# EAGLE design projekt (EAGLE 9.6.2)
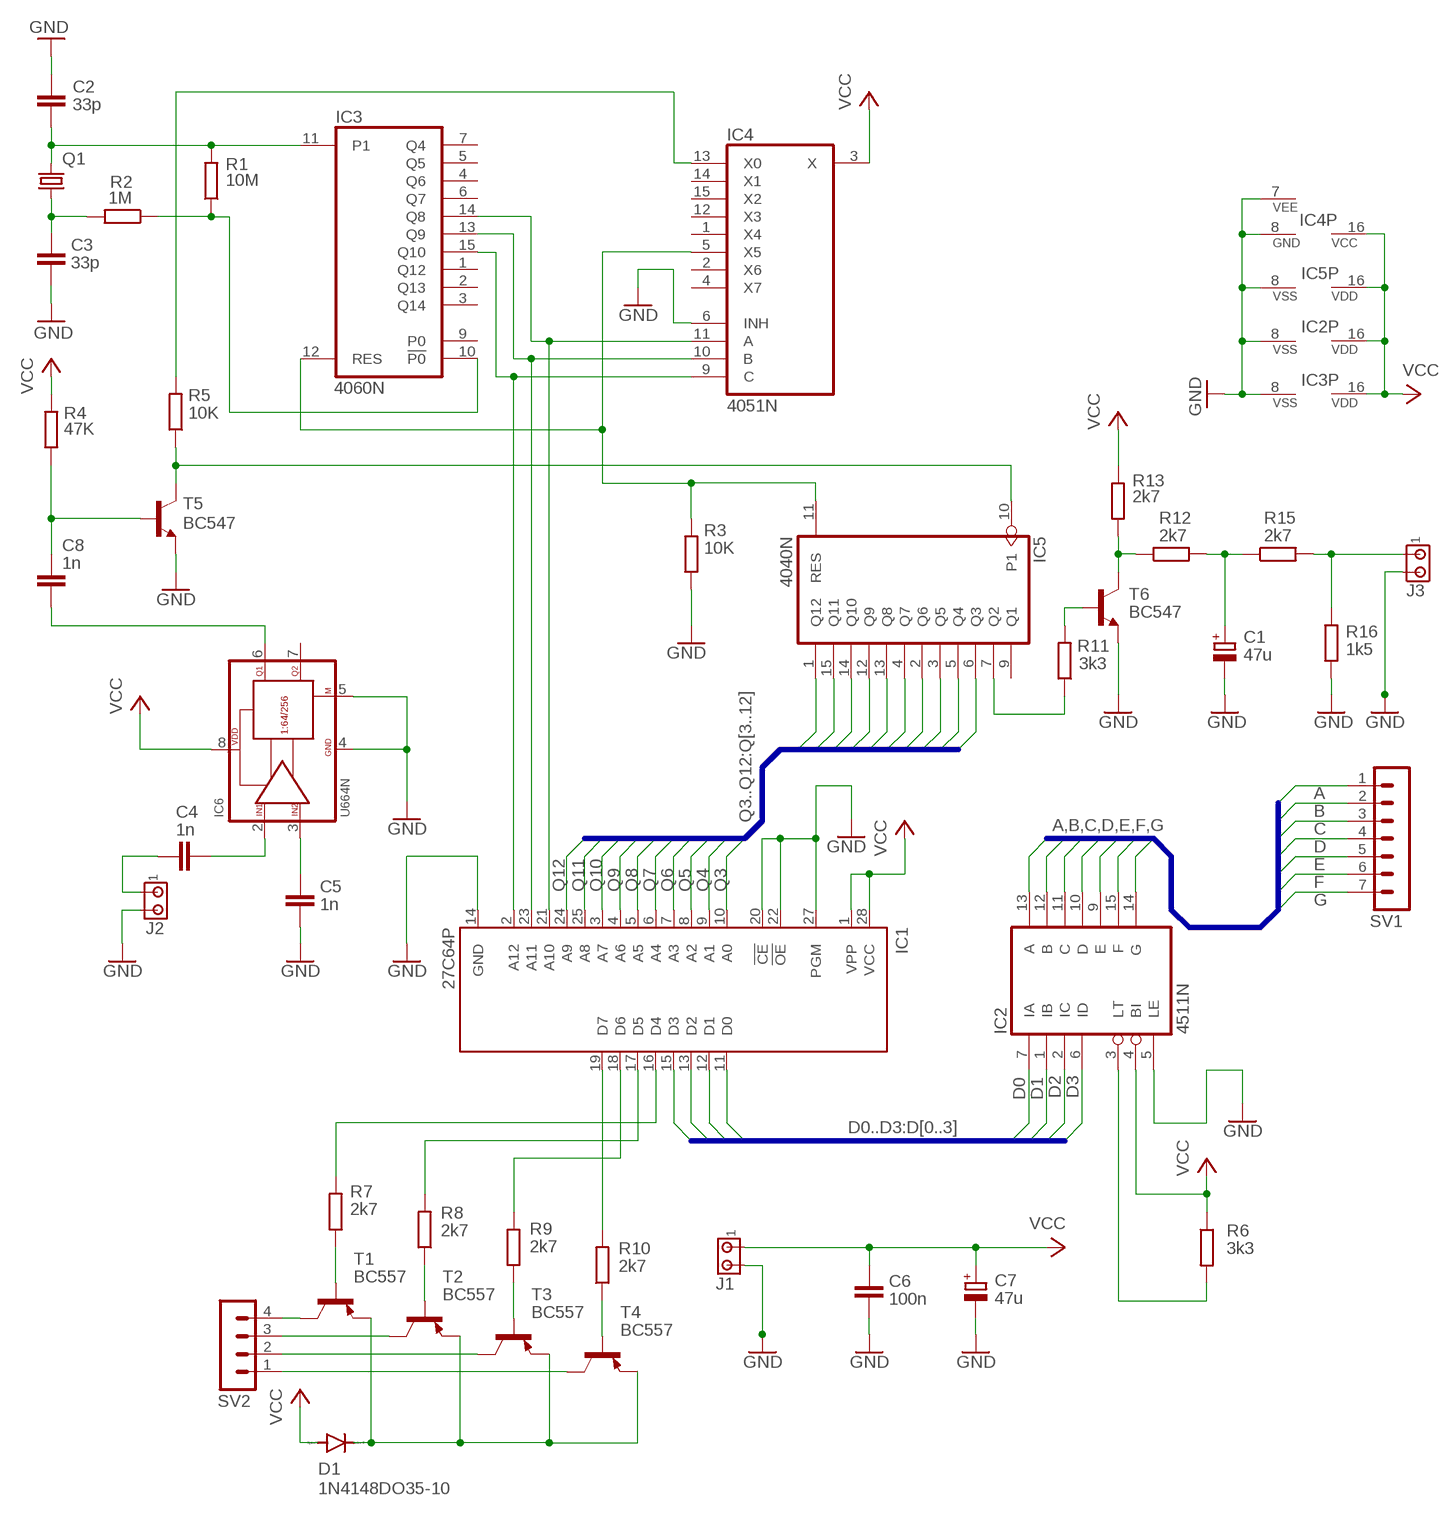
[diagram p0: schematic, sheet 1]

## Parts
C1  47u  CPOL-EUE2.5-6  [E2,5-6]
C2  33p  C-EU025-025X050  [C025-025X050]
C3  33p  C-EU025-025X050  [C025-025X050]
C4  1n  C-EU025-025X050  [C025-025X050]
C5  1n  C-EU025-025X050  [C025-025X050]
C6  100n  C-EU025-025X050  [C025-025X050]
C7  47u  CPOL-EUE2.5-6  [E2,5-6]
C8  1n  C-EU025-025X050  [C025-025X050]
D1  1N4148DO35-10  [DO35-10]
IC1  27C64P  [DIL28-6]
IC2  4511N  [DIL16]
IC3  4060N  [DIL16]
IC4  4051N  [DIL16]
IC5  4040N  [DIL16]
IC6  U664N  [DIL08]
J1  MTA02-100  [10X02MTA]
J2  MTA02-100  [10X02MTA]
J3  MTA02-100  [10X02MTA]
Q1  CRYSTALHC49S  [HC49/S]
R1  10M  R-EU_0207/10  [0207/10]
R2  1M  R-EU_0207/10  [0207/10]
R3  10K  R-EU_0207/10  [0207/10]
R4  47K  R-EU_0207/10  [0207/10]
R5  10K  R-EU_0207/10  [0207/10]
R6  3k3  R-EU_0207/10  [0207/10]
R7  2k7  R-EU_0207/10  [0207/10]
R8  2k7  R-EU_0207/10  [0207/10]
R9  2k7  R-EU_0207/10  [0207/10]
R10  2k7  R-EU_0207/10  [0207/10]
R11  3k3  R-EU_0207/10  [0207/10]
R12  2k7  R-EU_0207/10  [0207/10]
R13  2k7  R-EU_0207/10  [0207/10]
R15  2k7  R-EU_0207/10  [0207/10]
R16  1k5  R-EU_0207/10  [0207/10]
SV1  MA07-1  [MA07-1]
SV2  MA04-1  [MA04-1]
T1  BC557  [TO92]
T2  BC557  [TO92]
T3  BC557  [TO92]
T4  BC557  [TO92]
T5  BC547  [TO92]
T6  BC547  [TO92]

## Nets
A: IC2.13(A) SV1.1
B: IC2.12(B) SV1.2
C: IC2.11(C) SV1.3
D: IC2.10(D) SV1.4
D0: IC1.11(D0) IC2.7(IA)
D1: IC1.12(D1) IC2.1(IB)
D2: IC1.13(D2) IC2.2(IC)
D3: IC1.15(D3) IC2.6(ID)
E: IC2.9(E) SV1.5
F: IC2.15(F) SV1.6
G: IC2.14(G) SV1.7
GND: C1.- C2.1 C3.2 C5.2 C6.2 C7.- IC1.14(GND) IC1.20(!CE) IC1.22(!OE) IC1.27(PGM) IC2.5(LE) IC2.8(VSS) IC3.8(VSS) IC4.6(INH) IC4.7(VEE) IC4.8(GND) IC5.8(VSS) IC6.4(GND) IC6.5(FAKT) J1.2 J2.2 J3.2 R3.1 R16.1 T5.1(E) T6.1(E)
N$1: C2.2 IC3.11(P1) Q1.2 R1.2
N$2: C3.1 Q1.1 R2.2
N$3: IC3.10(!P0) R1.1 R2.1
N$4: IC1.21(A10) IC3.14(Q8) IC4.11(A)
N$5: IC1.23(A11) IC3.13(Q9) IC4.10(B)
N$6: IC1.2(A12) IC3.15(Q10) IC4.9(C)
N$7: IC3.12(RES) IC4.5(X5) IC5.11(RES) R3.2
N$8: C8.1 R4.1 T5.2(B)
N$9: C8.2 IC6.6(O1)
N$10: C5.1 IC6.3(I2)
N$11: C4.2 IC6.2(I1)
N$12: IC5.10(P1) R5.1 T5.3(C)
N$13: C4.1 J2.1
N$14: R12.1 R13.2 T6.3(C)
N$30: IC2.3(LT) R6.2
N$37: IC1.17(D5) R8.2
N$38: IC1.16(D4) R7.2
N$39: IC1.18(D6) R9.2
N$40: IC1.19(D7) R10.2
N$41: D1.C T1.1(E) T2.1(E) T3.1(E) T4.1(E)
N$42: R9.1 T3.2(B)
N$43: R8.1 T2.2(B)
N$44: R7.1 T1.2(B)
N$45: SV2.4 T1.3(C)
N$46: SV2.3 T2.3(C)
N$47: SV2.2 T3.3(C)
N$48: SV2.1 T4.3(C)
N$49: R10.1 T4.2(B)
N$50: IC5.7(Q2) R11.1
N$51: R11.2 T6.2(B)
N$52: C1.+ R12.2 R15.1
N$53: J3.1 R15.2 R16.2
N$62: IC4.13(X0) R5.2
Q3: IC1.10(A0) IC5.6(Q3)
Q4: IC1.9(A1) IC5.5(Q4)
Q5: IC1.8(A2) IC5.3(Q5)
Q6: IC1.7(A3) IC5.2(Q6)
Q7: IC1.6(A4) IC5.4(Q7)
Q8: IC1.5(A5) IC5.13(Q8)
Q9: IC1.4(A6) IC5.12(Q9)
Q10: IC1.3(A7) IC5.14(Q10)
Q11: IC1.25(A8) IC5.15(Q11)
Q12: IC1.24(A9) IC5.1(Q12)
VCC: C6.1 C7.+ D1.A IC1.1(VPP) IC1.28(VCC) IC2.4(BI) IC2.16(VDD) IC3.16(VDD) IC4.3(X) IC4.16(VCC) IC5.16(VDD) IC6.8(VPP) J1.1 R4.2 R6.1 R13.1
Unconnected: IC1.26(NC) IC3.1(Q12) IC3.2(Q13) IC3.3(Q14) IC3.4(Q6) IC3.5(Q5) IC3.6(Q7) IC3.7(Q4) IC3.9(P0) IC4.1(X4) IC4.2(X6) IC4.4(X7) IC4.12(X3) IC4.14(X1) IC4.15(X2) IC5.9(Q1) IC6.7(O2)

## Buses
Q3..Q12:Q[3..12]
D0..D3:D[0..3]
A,B,C,D,E,F,G

## Library data of the parts
C1 C7 = rcl:CPOL-EU: POLARIZED CAPACITOR, European symbol; SPICEPREFIX: C
C2-C6 C8 = rcl:C-EU: CAPACITOR, European symbol; SPICEPREFIX: C
D1 = diode:1N4148: DIODE high speed (Philips)
IC1 = microchip:27*64: CMOS EPROM 64 K (8 K x 8), low voltage; MF: Arrow Electronics; MPN: M27C64A-10F1; OC_FARNELL: 1094265; OC_NEWARK: 93K7339
IC2 = 45xx:4511: BCD to 7-segment LATCH/DECODER/DRIVER
IC3 = 40xx:4060: 14-stage binary/ripple COUNTER
IC4 = 40xx:4051: 8-channel ANALOG MULTIPLEXER
IC5 = 40xx:4040: 12-stage binary/ripple COUNTER
IC6 = U664:U664: High-Frequency prescaler for TV and VTR purposes U664/U981/SDA4212
J1-J3 = con-amp:MTA02-100: AMP connector
Q1 = crystal:CRYSTAL: CRYSTAL; OC_FARNELL: 1667008; OC_NEWARK: unknown
R1-R13 R15 R16 = rcl:R-EU_: RESISTOR, European symbol; SPICEPREFIX: R
SV1 = con-lstb:MA07-1: PIN HEADER; OC_FARNELL: unknown; OC_NEWARK: unknown
SV2 = con-lstb:MA04-1: PIN HEADER; OC_FARNELL: unknown; OC_NEWARK: unknown
T1-T4 = transistor-pnp:BC557: PNP Transistor
T5 T6 = transistor:BC547: NPN TRANSISTOR

## Board
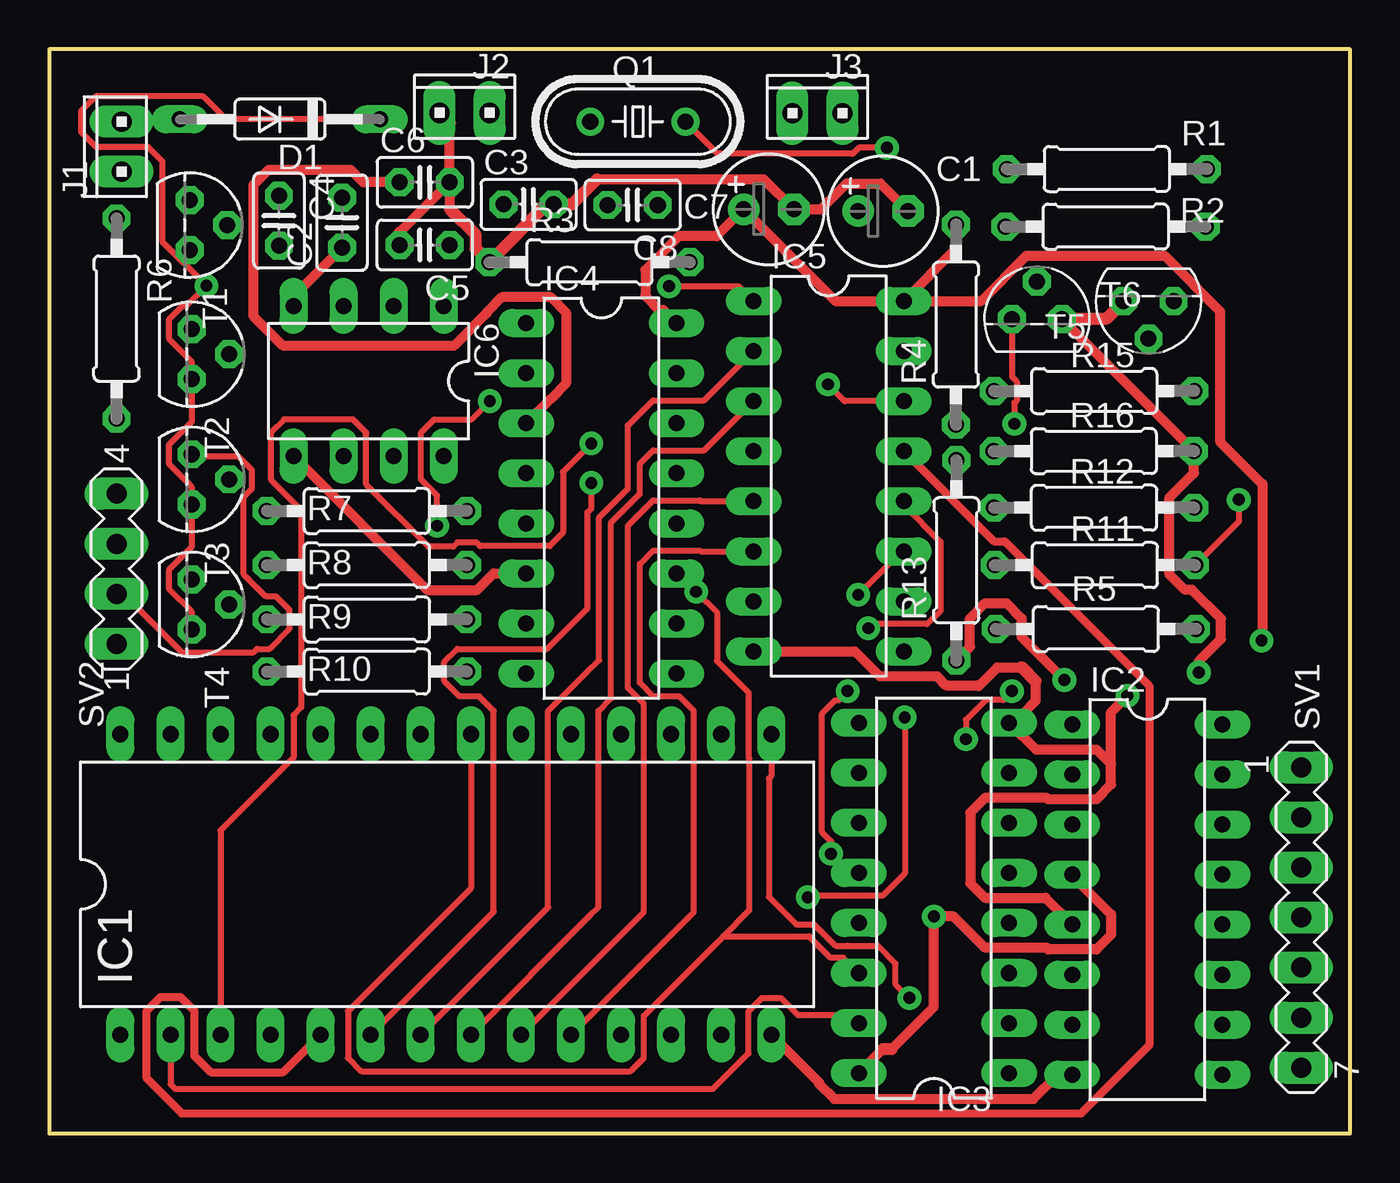
[diagram p1: board, top side]
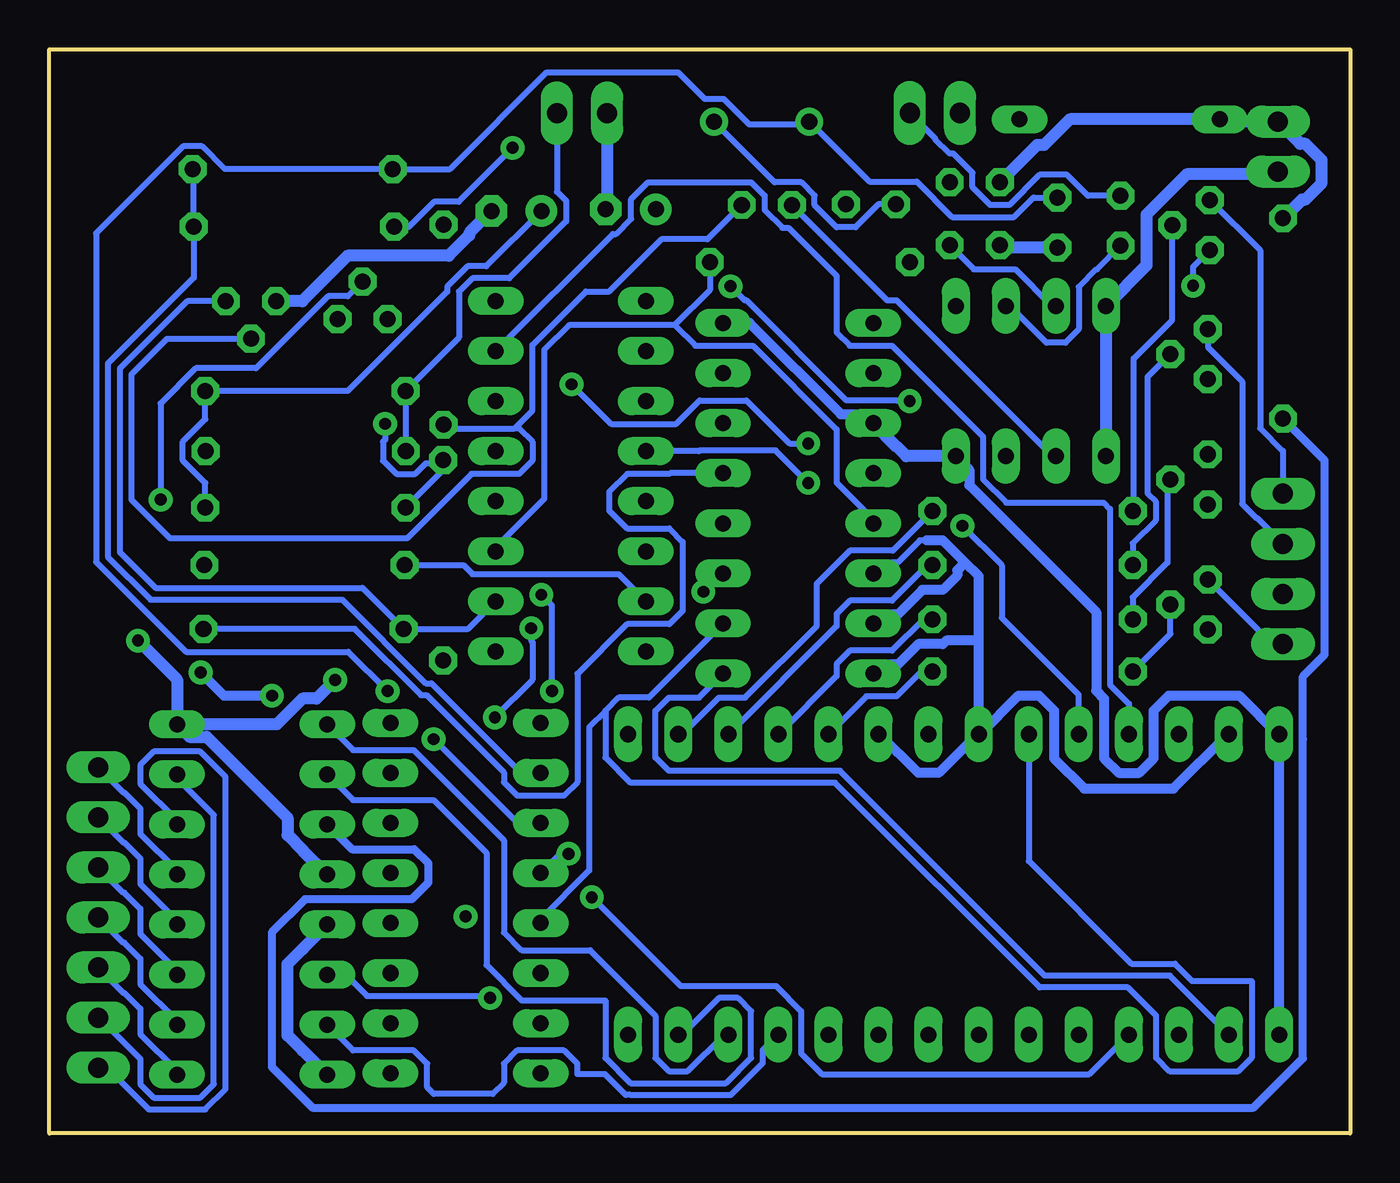
[diagram p2: board, bottom side, seen from below]

Size 66 x 55 mm. Coordinates in mm from the lower left corner, seen from the top.
Outline: 0,0 66,0 66,55 0,55 0,0
Copper layers (1*16): Top 0.035mm / dielectric 1.5mm / Bottom 0.035mm
Design rules "2 vrstvy trida 4": minimum track width 0.3mm, minimum drill 0.6mm, track to track 0.3mm, track to pad 0.3mm, pad to pad 0.3mm, via to via 0.3mm, smd to smd 0.3mm, copper to edge 0.5mm, drill to drill 0.6mm, minimum pad ring 0.3mm, minimum via ring 0.3mm, stop-mask expansion 0.1mm, vias tented up to drill 3mm, thermal gap 0.3mm

### Footprints (pad centres in the part's own frame; a part is rotated, then mirrored left to right if it is on the bottom)
E2,5-6 = drill 0.813 pad 1.6: + -1.27,0 | drill 0.813 pad 1.6 octagon: - 1.27,0
C025-025X050 = drill 0.813 octagon: 1 -1.27,0; 2 1.27,0
DO35-10 = drill 0.813 long: A 5.08,0; C -5.08,0
DIL28-6 = drill 0.813 long: 1 -16.51,-7.62; 2 -13.97,-7.62; 3 -11.43,-7.62; 4 -8.89,-7.62; 5 -6.35,-7.62; 6 -3.81,-7.62; 7 -1.27,-7.62; 8 1.27,-7.62; 9 3.81,-7.62; 10 6.35,-7.62; 11 8.89,-7.62; 12 11.43,-7.62; 13 13.97,-7.62; 14 16.51,-7.62; 15 16.51,7.62; 16 13.97,7.62; 17 11.43,7.62; 18 8.89,7.62; 19 6.35,7.62; 20 3.81,7.62; 21 1.27,7.62; 22 -1.27,7.62; 23 -3.81,7.62; 24 -6.35,7.62; 25 -8.89,7.62; 26 -11.43,7.62; 27 -13.97,7.62; 28 -16.51,7.62
DIL16 = drill 0.813 long: 1 -8.89,-3.81; 2 -6.35,-3.81; 3 -3.81,-3.81; 4 -1.27,-3.81; 5 1.27,-3.81; 6 3.81,-3.81; 7 6.35,-3.81; 8 8.89,-3.81; 9 8.89,3.81; 10 6.35,3.81; 11 3.81,3.81; 12 1.27,3.81; 13 -1.27,3.81; 14 -3.81,3.81; 15 -6.35,3.81; 16 -8.89,3.81
DIL08 = drill 0.813 long: 1 -3.81,-3.81; 2 -1.27,-3.81; 3 1.27,-3.81; 4 3.81,-3.81; 5 3.81,3.81; 6 1.27,3.81; 7 -1.27,3.81; 8 -3.81,3.81
10X02MTA = drill 1.016 long: 1 1.27,0; 2 -1.27,0
HC49/S = drill 0.813: 1 -2.413,0; 2 2.413,0
0207/10 = drill 0.813 octagon: 1 -5.08,0; 2 5.08,0
MA07-1 = drill 1.016 long: 1 -7.62,0; 2 -5.08,0; 3 -2.54,0; 4 0,0; 5 2.54,0; 6 5.08,0; 7 7.62,0
MA04-1 = drill 1.016 long: 1 -3.81,0; 2 -1.27,0; 3 1.27,0; 4 3.81,0
TO92 = drill 0.813 octagon: 1 1.27,0; 2 0,1.905; 3 -1.27,0

### Placement (x,y rotation side)
C1  42.3,46.79 0 top
C2  14.85,46.21 90 top
C3  24.31,47.13 0 top
C4  11.65,46.3 270 top
C5  19.05,45.07 180 top
C6  19.05,48.25 0 top
C7  36.5,46.88 0 top
C8  29.6,47.1 180 top
D1  11.7,51.45 180 top
IC1  20.12,12.63 0 top
IC2  55.71,11.86 270 top
IC3  44.88,11.94 90 top
IC4  28.01,32.22 270 top
IC5  39.54,33.34 270 top
IC6  16.2,38.17 180 top
J1  3.67,50.06 90 top
J2  21.07,51.77 0 top
J3  38.97,51.76 0 top
Q1  29.86,51.33 180 top
R1  53.65,48.92 180 top
R2  53.59,46 180 top
R3  27.41,44.2 0 top
R4  46,41.03 90 top
R5  53.1,25.59 0 top
R6  3.41,41.34 270 top
R7  16.11,31.58 0 top
R8  16.11,28.83 0 top
R9  16.11,26.08 0 top
R10  16.11,23.43 0 top
R11  53.05,28.83 0 top
R12  53.01,31.74 0 top
R13  46.02,29.07 90 top
R15  53.01,37.66 180 top
R16  52.99,34.61 180 top
SV1  63.52,10.95 270 top
SV2  3.41,28.64 90 top
T1  7.12,46.08 270 top
T2  7.22,39.53 270 top
T3  7.22,33.18 270 top
T4  7.22,26.83 270 top
T5  55.77,42.22 180 top
T6  50.11,41.31 0 top

### Tracks (layer width: path | path; a pad name or v marks a point on that pad's centre or on a via)
A
  Bottom 0.3: SV1.1 62.24,17.29 62.19,17.29 61.38,16.48 61.38,15.19 59.52,13.33 IC2.13
B
  Bottom 0.3: SV1.2 62.24,14.75 62.19,14.75 61.38,13.94 61.38,12.65 59.52,10.79 IC2.12
C
  Bottom 0.3: SV1.3 62.24,12.21 62.19,12.21 61.38,11.4 61.38,10.11 59.52,8.25 IC2.11
D
  Bottom 0.3: SV1.4 62.24,9.67 62.19,9.67 61.38,8.86 61.38,7.57 59.52,5.71 IC2.10
D0
  Bottom 0.3: IC1.11 29.79,4.23 29.79,3.58 31.42,1.95 36.5,1.95 36.76,1.95 37.81,3 39.21,3 39.21,3.53 39.89,4.21 42.25,4.21 42.93,3.53 42.93,2.57 43.5,2 46.5,2 46.83,2.33 46.83,3.53 47.5,4.21 50.6,4.21 IC2.7
D1
  Bottom 0.3: IC2.1 50.6,19.45 47.5,19.45 42.93,14.88 42.93,10.19 42.03,9.29 38.56,9.29 35.25,5.97 35.25,3.82 34.57,3.15 33.61,3.15 31.75,5.01 IC1.12
D2
  Bottom 0.3: IC2.2 50.6,16.91 46.5,16.91 43.83,14.23 43.83,8.55 42.03,6.75 37.79,6.75 37.79,3.82 36.51,2.55 31.67,2.55 30.39,3.82 30.39,6.2 31.07,6.87 32.03,6.87 33.89,5.01 IC1.13
D3  (via drill 0.6)
  Top 0.3: v43.63,6.87 42.93,7.57 42.93,8.61 42.03,9.51 40.5,9.51 39.89,9.51 38.8,10.6 37.9,10.6 36.5,12 36.5,18 36.63,18.13 IC1.15
  Bottom 0.3: IC2.6 50.95,8.05 49.88,6.97 43.74,6.97 v43.63,6.87
E
  Bottom 0.3: SV1.5 62.24,7.13 62.19,7.13 61.38,6.32 61.38,5.03 59.52,3.17 IC2.9
F
  Bottom 0.3: IC2.15 59.52,18.01 57.66,16.15 57.66,2.49 58.33,1.81 60.7,1.81 61.38,2.49 61.38,3.78 63.47,5.87 SV1.6
G
  Bottom 0.3: SV1.7 63.07,3.33 60.95,1.21 58.09,1.21 57.06,2.24 57.06,18.09 58.33,19.37 60.7,19.37 61.38,18.69 61.38,17.73 59.52,15.87 IC2.14
GND  (via drill 0.6)
  Top 0.5: C6.2 17.78,45.71 | C6.2 20.32,46.92 | C6.2 20.32,51.25 | C2.1 12.39,42.48 IC6.4 | C1.- 42.17,48.19 40.45,48.19 39.14,46.88 C7.- 36.24,48.41 27.79,48.41 | T6.1 R16.1 58.07,33.5 56.83,32.26 56.83,28.35 57.61,27.57 57.97,27.57 59.44,26.11 59.44,25.07 58.32,23.95 v58.32,23.38 | IC2.8 51.16,2.97 49.94,1.74 39.82,1.74 39.06,2.51 39.06,2.58 IC1.14 | 50.03,22.93 50.03,21.94 49.33,21.24 49.1,21.24 IC3.8 50.05,19.47 53.13,19.47 53.86,18.73 | 49.33,23.64 48.09,23.64 47.14,22.68 47.09,22.73 45.5,22.73 45.04,23.19 42.12,23.19 40.87,24.45 IC5.8 | 53.86,18.73 53.86,17.69 53.13,16.95 50.67,16.95 50.62,17.01 47.46,17.01 46.73,16.27 46.73,12.69 47.46,11.95 50.54,11.95 IC2.5 | IC4.6 22.55,28.41 21.71,27.57 19.18,27.57 IC6.5 | 53.86,18.73 53.86,21.36 v54.7,22.2
  Top 0.6: 17.78,45.71 C5.2 | 20.32,46.92 21.63,45.61 21.63,44.9 R3.1 25.26,47.13 C3.2 26.51,47.13 27.79,48.41 | 20.32,51.25 J2.2 | T5.1 53.59,41.31 T6.1 | R16.1 | 49.33,23.64 50.03,22.93
  Bottom 0.3: 21.5,30.09 21.84,30.09 22.95,28.97 23.64,28.97 IC4.6
  Bottom 0.5: 21.5,30.09 20.67,30.09 19.54,28.96 | IC1.22 18.85,25 | 18.85,25 18.85,28.27 19.54,28.96 | IC4.7 23.74,26.33 22.95,26.33 21.7,27.57 20.67,27.57 19.93,28.31 19.93,28.57 19.54,28.96 | 18.85,25 20.49,25 20.67,24.82 21.91,24.82 22.95,23.79 23.74,23.79 IC4.8 | IC1.22 18.79,20.25 16.83,22.21 15.79,22.21 15.03,21.45 15.03,19.02 13.49,17.49 8.97,17.49 6.21,20.25 IC1.27 | IC1.22 18.91,20.25 20.87,18.29 21.91,18.29 23.87,20.25 IC1.20 | v54.7,22.2 57.14,22.2 v58.32,23.38
  Bottom 0.6: J1.2 3.8,48.66 8.3,48.66 10.33,46.62 10.33,44.04 IC6.4 IC6.5 | C2.1 17.65,44.94 C5.2 | J3.2 37.7,46.95 C7.- | C1.- 44.69,45.67 44.69,45.57 45.74,44.52 50.86,44.52 53.17,42.22 T5.1 | IC2.8 53.13,4.2 53.15,4.2 53.91,4.97 53.91,8.59 53.15,9.36 53.13,9.36 IC2.5
N$1  (via drill 0.6)
  Top 0.3: v48.83,22.44 48.39,21.99 47.5,21.99 46.5,20.98 v46.5,20
  Bottom 0.3: C2.2 16.07,47.48 17.05,46.49 20.2,46.49 21.99,48.29 24.4,48.29 27.31,51.19 | Q1.2 27.31,51.19 | 27.31,51.19 30.5,51.19 31.79,52.49 32.75,52.49 34.09,53.83 40.76,53.83 45.67,48.92 R1.2 57.09,48.92 58.25,50.08 59.21,50.08 63.63,45.66 63.63,28.99 59.07,24.43 50.83,24.43 v48.83,22.44 | v46.5,20 42.25,15.75 IC3.11
N$2  (via drill 0.6)
  Top 0.3: v42.5,50 41.07,50 40.76,49.69 33.91,49.69 Q1.1
  Bottom 0.3: C3.1 23.95,47.13 25.1,45.97 26.06,45.97 27.17,47.09 27.17,47.58 27.85,48.26 29.2,48.26 Q1.1 | v42.5,50 45.23,47.27 46.48,47.27 47.75,46 R2.2
N$3
  Bottom 0.3: R1.1 58.67,48.86 R2.1 58.67,43.41 63.03,39.06 63.03,29.24 60.86,27.07 51.14,27.07 46.9,22.83 46.61,22.83 42.07,18.29 IC3.10
N$4  (via drill 0.6)
  Top 0.3: IC3.14 40.29,8.91 39.64,8.91 38.55,10 34.2,10 | v32.82,27.48 33.87,26.43 33.87,23.97 35.47,22.37 35.47,19.06 35.5,19.04 35.5,11.3 34.2,10 | IC1.21 21.39,12.43 15.15,6.2 15.15,3.82 15.83,3.15 29.49,3.15 30.17,3.82 30.17,5.97 34.2,10
  Bottom 0.3: IC4.11 32.75,27.48 v32.82,27.48
N$5
  Bottom 0.3: IC3.13 41.07,10.87 38.61,13.33 38.61,20.62 37.79,21.44 | 37.79,21.44 37.11,22.11 35.58,22.11 IC4.10 | 37.79,21.44 37.79,19.06 36.51,17.79 26.14,17.79 15.75,7.4 11.28,7.4 9.85,5.97 9.85,3.82 9.17,3.15 5.67,3.15 4.99,3.82 4.99,7.73 8.03,7.73 8.89,8.6 11.1,8.6 16.31,13.81 IC1.23
N$6
  Top 0.3: IC1.2 6.15,2.5 6.4,2.25 33.67,2.25 35.47,4.05 35.47,6.2 36.15,6.87 37.11,6.87 37.98,6 40.66,6 IC3.15
  Bottom 0.3: IC4.9 33.04,22.11 34.57,22.11 35.25,21.44 35.25,19.06 34.57,18.39 25.89,18.39 15.5,8 9.14,8 IC1.2
N$7  (via drill 0.6)
  Top 0.3: v39.66,14.18 39.66,14.82 39.21,15.27 39.21,21.31 39.89,21.99 40.05,21.99 v40.5,22.44 | v41.04,27.32 43.24,29.53 IC5.11
  Bottom 0.3: R3.2 32.49,42.78 34.27,41 | IC3.12 40.09,14.18 v39.66,14.18 | v40.5,22.44 40.5,26.79 v41.04,27.32 | IC4.5 24.2,31.15 26.06,33.01 26.06,35.72 30.3,39.95 33.22,39.95 34.27,41 | IC5.11 43.35,29.73 40.89,32.19 40.89,39.75 39.64,41 34.27,41
N$8
  Bottom 0.3: T5.2 60.03,40.31 61.83,38.52 61.83,32.14 59.87,30.18 47.85,30.18 44.58,33.45 42.17,33.45 41.49,34.13 41.49,35.09 42.17,35.77 42.39,35.77 | R4.1 45.82,35.77 42.39,35.77 | C8.1 32.61,45.36 34.94,45.36 37.59,42.71 38.78,42.71 41.49,40 41.49,36.67 42.39,35.77
N$9
  Bottom 0.3: C8.2 23.5,42.27 23.02,42.27 15.11,34.36 IC6.6
N$10
  Bottom 0.3: C5.1 19.09,43.84 16.99,43.84 15.13,41.98 IC6.3
N$11
  Bottom 0.3: C4.2 12.84,43.84 12.87,43.84 13.77,42.94 13.77,40.8 14.45,40.12 15.41,40.12 17.27,41.98 IC6.2
N$12
  Bottom 0.3: T5.3 59.01,42.22 62.43,38.81 62.43,29.49 60.61,27.67 50.1,27.67 R5.1 44.75,25.59 IC5.10
N$13
  Bottom 0.3: J2.1 21.06,50.49 21.06,50.44 20.32,49.7 20.14,49.7 19.16,48.73 19.16,48 18.26,47.09 17.3,47.09 15.76,48.64 14.37,48.64 13.3,47.57 C4.1
N$14  (via drill 0.6)
  Top 0.3: T6.3 48.84,38.38 49.09,38.14 49.09,37.18 48.96,37.05 v48.96,36
  Bottom 0.3: R12.1 46.02,33.65 46.02,34 | 46.02,34 R13.2 | 46.02,34 46.89,34 47.43,33.45 48.39,33.45 49.07,34.13 49.07,35.09 48.96,35.2 v48.96,36
N$30
  Bottom 0.4: IC2.3 50.65,14.42 47.48,14.42 46.78,13.71 46.78,12.71 47.61,11.88 53.03,11.88 54.71,10.19 54.71,3.37 52.64,1.3 4.91,1.3 2.4,3.8 2.4,20 2.4,23.18 1.29,24.29 1.29,34.14 R6.2
N$37
  Bottom 0.3: IC1.17 26.06,25.74 26.06,26.35 25.38,27.03 23.24,27.03 21.44,28.83 R8.2
N$38
  Bottom 0.3: R7.2 23.2,29.57 25.38,29.57 27.06,27.89 27.06,25.74 30.69,22.11 32.03,22.11 33.89,20.25 IC1.16
N$39
  Bottom 0.3: IC1.18 26.06,23.2 26.06,23.81 25.38,24.49 23.24,24.49 21.65,26.08 R9.2
N$40
  Bottom 0.3: IC1.19 24.55,22.17 23.02,22.17 21.76,23.43 R10.2
N$41  (via drill 0.6)
  Top 0.3: T4.1 7.22,26.47 6.06,27.62 6.06,28.58 7.22,29.73 T3.1 7.22,32.81 6.06,33.97 6.06,34.93 7.22,36.09 T2.1 7.22,39.16 6.06,40.32 6.06,41.28 6.74,41.96 6.93,41.96 v7.98,43 5.74,45.24 5.74,49.31 5,50.05 2.37,50.05 1.6,50.81 1.6,51.85 2.36,52.61 7.8,52.61 8.96,51.45 D1.C
  Bottom 0.3: T1.1 7.98,43.95 v7.98,43
N$42
  Bottom 0.3: T3.2 9.27,33.03 9.27,28.95 11.03,27.2 R9.1
N$43
  Bottom 0.3: R8.1 11.03,29.95 9.87,31.1 9.87,32.06 10.28,32.47 10.28,38.37 T2.2
N$44
  Bottom 0.3: R7.1 10.98,31.63 10.98,39.31 9.02,41.27 T1.2
N$45
  Bottom 0.3: SV2.4 3.41,34.62 4.57,35.78 4.57,44.8 T1.3
N$46
  Bottom 0.3: SV2.3 4.69,31.19 4.74,31.19 5.48,31.93 5.48,38.15 7.22,39.9 T2.3
N$47
  Top 0.3: SV2.2 3.77,27.37 6.74,24.4 10.37,24.4 10.55,24.59 11.17,24.59 12.19,25.6 12.19,26.56 11.51,27.24 10.99,27.24 9.87,28.35 9.87,32.29 10.28,32.7 10.28,33.66 9.6,34.34 7.33,34.34 T3.3
N$48
  Bottom 0.3: T4.3 3.95,24.83 SV2.1
N$49
  Bottom 0.3: R10.1 9.12,25.34 T4.2
N$50
  Bottom 0.3: R11.1 44.99,28.83 44.53,28.37 37.11,28.37 IC5.7
N$51  (via drill 0.6)
  Top 0.3: v60.35,32.15 60.35,31.05 R11.2
  Bottom 0.3: T6.2 50.86,42.47 51.86,42.47 55.51,38.82 58.57,38.82 60.35,37.03 v60.35,32.15
N$52
  Bottom 0.3: C1.+ 43.83,43.99 44.78,43.99 45.81,42.96 45.81,42.7 50.86,37.66 R15.1 58.09,36.23 59.23,35.09 59.23,34.13 58.09,32.99 R12.2
N$53
  Bottom 0.3: J3.1 40.24,47.77 39.78,47.31 39.78,46.27 42.67,43.39 44.53,43.39 45.21,42.71 45.21,40.38 47.91,37.68 | 47.91,37.68 R15.2 | R16.2 47.91,37.68
N$62
  Bottom 0.3: IC4.13 34.51,33.49 34.55,33.45 36.69,33.45 37.59,32.55 37.59,31.59 36.69,30.69 34.55,30.69 33.87,30.01 33.87,26.51 34.55,25.83 36.69,25.83 39.21,23.31 39.21,17.81 39.89,17.13 42.25,17.13 42.93,17.81 42.93,18.3 46.86,22.23 47.15,22.23 50.5,25.59 R5.2
Q3
  Top 0.3: IC5.6 33.04,29.53 33,29.57 30.64,29.57 29.96,28.89 29.96,22.85 30.64,22.17 31.97,22.17 32.71,21.44 32.71,11.25 IC1.10
Q4
  Top 0.3: IC5.5 33.04,32.07 33,32.11 30.64,32.11 29.36,30.83 29.36,22.6 30.17,21.79 30.17,11.25 IC1.9
Q5
  Top 0.3: IC1.8 27.44,11.06 27.85,11.47 27.85,21.44 28.5,22.08 28.5,31 29.96,32.46 29.96,33.97 30.64,34.65 33.23,34.65 IC5.3
Q6
  Top 0.3: IC1.7 25.31,11.47 25.31,21.44 27.19,23.31 27.25,23.38 27.88,24 27.9,24 27.9,31.25 29.36,32.71 29.36,35.91 30.64,37.19 33.23,37.19 IC5.2
Q7  (via drill 0.6)
  Top 0.3: v27.5,33 27.5,31.7 27.3,31.5 27.3,26.63 25.26,24.59 20.71,24.59 20.03,23.91 20.03,22.95 20.81,22.17 21.81,22.17 22.55,21.44 22.55,11.25 IC1.6
  Bottom 0.3: IC5.4 33.04,34.61 33,34.65 29.15,34.65 v27.5,33
Q8
  Top 0.4: IC5.13 47.92,30.04 48.47,30.04 55.8,22.71 55.8,4.46 52.34,0.99 6.74,0.99 4.94,2.79 4.94,6.22 5.65,6.92 6.65,6.92 7.36,6.22 7.36,3.93 8.19,3.1 11.86,3.1 IC1.5
Q9  (via drill 0.6)
  Top 0.3: IC5.12 43.35,31.87 45.21,30.01 45.21,26.51 44.53,25.83 41.75,25.83 v41.55,25.63 | v38.48,11.98 38.55,12.05 42.25,12.05 43.4,13.2 v43.4,21.1
  Bottom 0.3: v41.55,25.63 41.55,24.99 41.49,24.93 41.49,23.01 v43.4,21.1 | IC1.4 13.24,3 26.8,3 27.85,4.05 27.85,6.2 29.13,7.47 33.97,7.47 v38.48,11.98
Q10  (via drill 0.6)
  Top 0.3: IC5.14 40.35,37.15 v39.5,38 | v27.5,35 26.06,33.56 26.06,30.47 25.38,29.79 21.86,29.79 21.67,29.99 20.71,29.99 20.5,29.77 19.24,29.77 16.09,32.93 16.09,35.55 15.41,36.22 11.91,36.22 11.23,35.55 11.23,33.17 12.79,31.62 12.79,21.61 12.39,21.21 12.39,19.06 8.69,15.37 IC1.3
  Bottom 0.3: v39.5,38 37.49,35.99 34.2,35.99 33,37.19 30.64,37.19 28.45,35 v27.5,35
Q11
  Bottom 0.3: IC5.15 37.41,45.63 37.25,45.63 36.48,46.4 36.48,47.4 35.62,48.26 30.39,48.26 29.71,47.58 29.71,46.85 28.81,45.94 28.5,45.94 26.06,43.51 26.06,40.63 25.38,39.95 23.24,39.95 18.63,35.34 18.63,33.17 17.45,32 12.5,32 12.19,31.69 12.19,22.75 11.23,21.8 IC1.25
Q12  (via drill 0.6)
  Top 0.3: v19.68,30.82 19.68,32.35 18.85,33.17 18.85,35.55 19.53,36.22 21.41,36.22 v22.35,37.15 | v31.44,42.98 34.98,42.98 IC5.1
  Bottom 0.3: IC1.24 13.77,22.25 17.68,26.16 17.68,28.82 v19.68,30.82 | v22.35,37.15 22.98,37.15 23.02,37.19 25.56,37.19 30.64,42.27 30.73,42.27 v31.44,42.98
VCC  (via drill 0.6)
  Top 0.5: IC5.16 46,44.88 R4.2 | IC4.16 31.15,41.78 30.94,41.78 30.24,42.48 30.24,43.8 31.95,45.51 33.86,45.51 C7.+ 39.88,42.23 IC5.16 | IC4.3 25.43,37.26 25.45,37.26 26.21,38.03 26.21,41.65 25.45,42.42 22.95,42.42 22.19,41.65 22.19,41.6 20.55,39.97 11.85,39.97 10.34,41.47 10.34,48.11 11.11,48.88 15.3,48.88 15.93,48.25 C6.1 | IC5.16 47.28,42.23 49.57,44.52 56.59,44.52 59.4,41.71 59.4,35.1 61.55,32.95 61.55,25.05 | R13.1 46.71,24.68 46.71,26.13 47.48,26.9 48.56,26.9 49.33,26.13 49.33,25.17 v51.5,23 | IC3.16 42.3,4.28 | 42.75,4.28 44.88,6.41 v44.88,11 45.88,11 47.46,9.41 50.59,9.41 50.67,9.33 53.13,9.33 53.86,10.07 53.86,11.11 51.9,13.07 IC2.4
  Top 0.6: 61.55,25.05 v61.5,25 | 42.3,4.28 42.75,4.28
  Bottom 0.5: IC1.1 IC1.28 3.67,20.25 5.63,22.21 9.21,22.21 9.97,21.45 9.97,19.02 10.71,18.29 11.75,18.29 12.49,19.02 12.49,22.06 12.89,22.46 12.89,26.45 19.33,32.88 19.33,33.68 IC6.8 | IC4.3 24.66,36.49 25.84,36.49 30.47,41.11 IC4.16
  Bottom 0.6: R6.1 2.45,47.38 2.28,47.38 1.45,48.21 1.45,49.37 2.28,50.2 2.54,50.2 J1.1 6.5,51.33 D1.A 14.23,51.45 15.53,50.14 15.89,50.14 C6.1 | IC6.8 22.52,34.36 22.95,34.8 22.97,34.8 IC4.3 | v61.5,25 59.52,23.02 IC2.16 | IC2.16 58.89,20.12 58.02,20.12 53.91,16 53.91,15.13 53.15,14.36 53.13,14.36 IC2.4 | v51.5,23 52.44,22.06 53.15,22.06 54.45,20.75 IC2.16